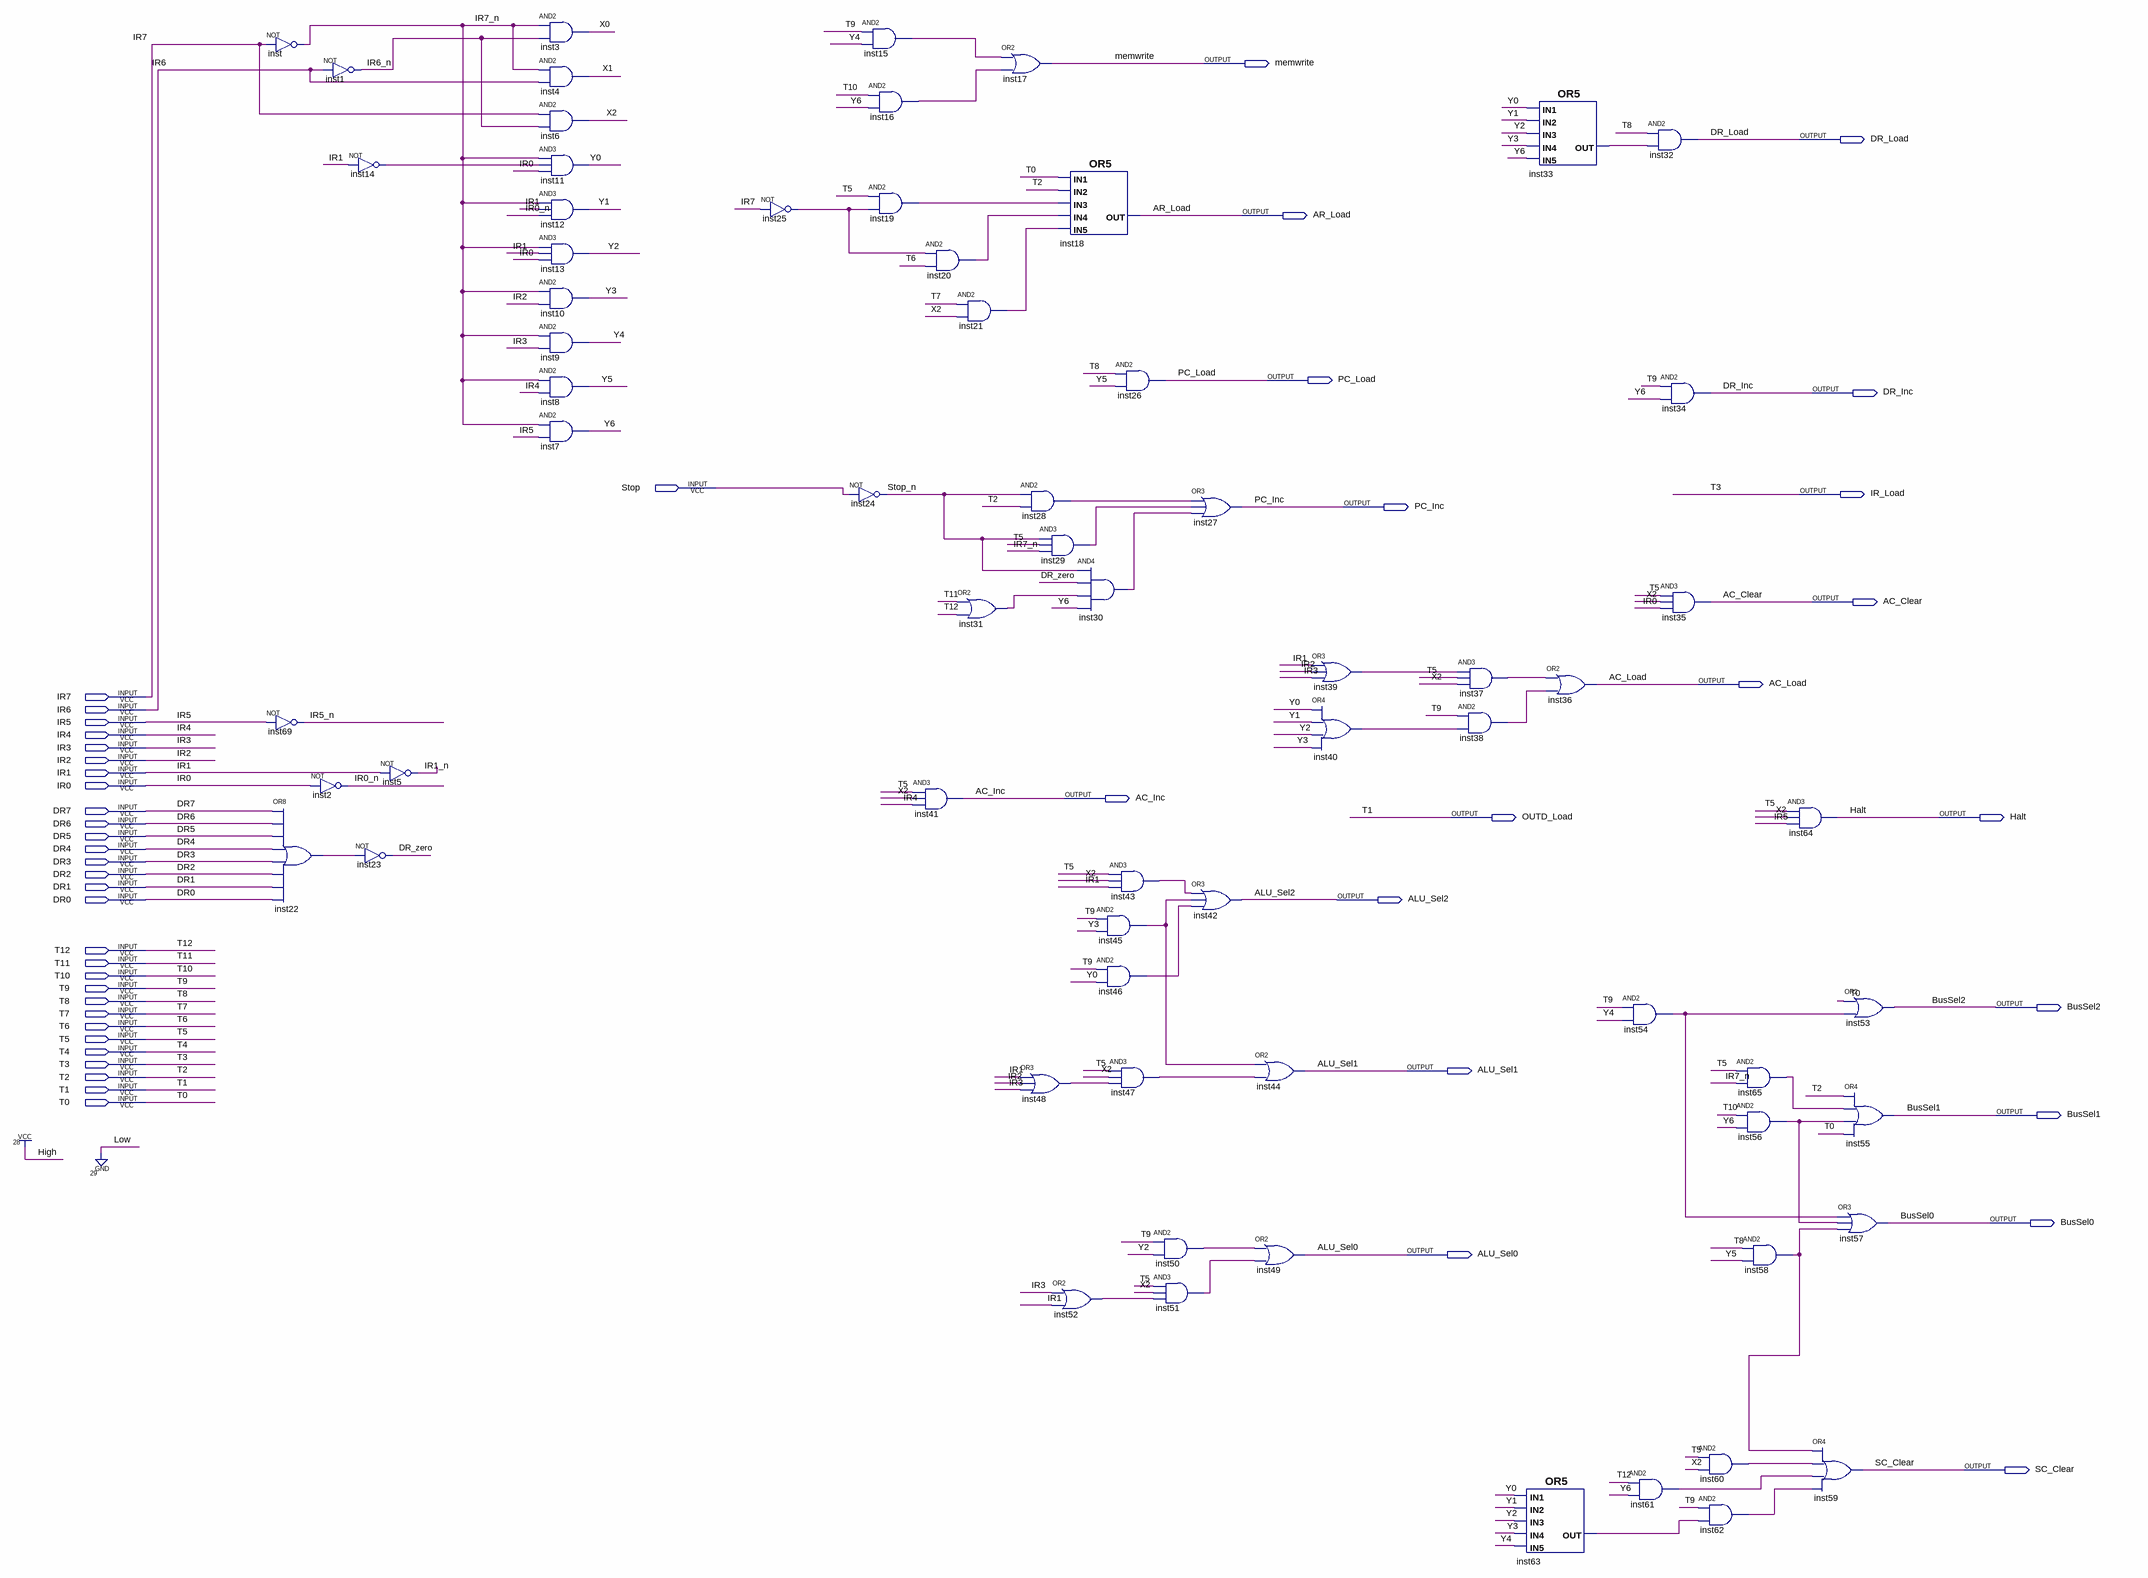
[diagram p0: schematic sheet]
// Quartus schematic lab4controller.bdf as structural Verilog: 67 symbols, 49 pins
module lab4controller (
  input  Stop,
  input  IR7,
  input  IR6,
  input  IR5,
  input  IR4,
  input  IR3,
  input  IR2,
  input  IR1,
  input  IR0,
  input  DR7,
  input  DR6,
  input  DR5,
  input  DR4,
  input  DR3,
  input  DR2,
  input  DR1,
  input  DR0,
  input  T12,
  input  T11,
  input  T10,
  input  T9,
  input  T8,
  input  T7,
  input  T6,
  input  T5,
  input  T4,
  input  T3,
  input  T2,
  input  T1,
  input  T0,
  output memwrite,
  output DR_Load,
  output AR_Load,
  output PC_Load,
  output DR_Inc,
  output IR_Load,
  output PC_Inc,
  output AC_Clear,
  output AC_Load,
  output AC_Inc,
  output OUTD_Load,
  output Halt,
  output ALU_Sel2,
  output BusSel2,
  output ALU_Sel1,
  output BusSel1,
  output BusSel0,
  output ALU_Sel0,
  output SC_Clear
);

  wire DR_zero, inst14_out, inst15_out, inst16_out, inst19_out, inst20_out, inst21_out, inst22_out,
       inst25_out, inst28_out, inst29_out, inst30_out, inst31_out, inst33_out, inst37_out, inst38_out,
       inst39_out, inst40_out, inst43_out, inst45_out, inst46_out, inst47_out, inst48_out, inst50_out,
       inst51_out, inst52_out, inst54_out, inst56_out, inst58_out, inst60_out, inst61_out, inst62_out,
       inst63_out, inst65_out, IR0_n, IR1_n, IR5_n, IR6_n, IR7_n, Stop_n, X0, X1, X2, Y0, Y1, Y2, Y3, Y4, Y5,
       Y6;

  not inst (IR7_n, IR7);
  not inst69 (IR5_n, IR5);
  not inst2 (IR0_n, IR0);
  or inst22 (inst22_out, DR7, DR6, DR5, DR4, DR3, DR2, DR1, DR0);
  not inst1 (IR6_n, IR6);
  not inst14 (inst14_out, IR1);
  not inst23 (DR_zero, inst22_out);
  not inst5 (IR1_n, IR1);
  and inst3 (X0, IR7_n, IR6_n);
  and inst4 (X1, IR7_n, IR6);
  and inst6 (X2, IR7, IR6_n);
  and inst11 (Y0, IR7_n, inst14_out, IR0);
  and inst12 (Y1, IR7_n, IR1, IR0_n);
  and inst13 (Y2, IR7_n, IR1, IR0);
  and inst10 (Y3, IR7_n, IR2);
  and inst9 (Y4, IR7_n, IR3);
  and inst8 (Y5, IR7_n, IR4);
  and inst7 (Y6, IR7_n, IR5);
  not inst25 (inst25_out, IR7);
  and inst15 (inst15_out, T9, Y4);
  and inst16 (inst16_out, T10, Y6);
  and inst19 (inst19_out, T5, inst25_out);
  not inst24 (Stop_n, Stop);
  and inst20 (inst20_out, inst25_out, T6);
  and inst41 (AC_Inc, T5, X2, IR4);
  and inst21 (inst21_out, T7, X2);
  or inst31 (inst31_out, T11, T12);
  or inst17 (memwrite, inst15_out, inst16_out);
  and inst28 (inst28_out, Stop_n, T2);
  or inst48 (inst48_out, IR1, IR2, IR3);
  or inst18 (AR_Load, T0, T2, inst19_out, inst20_out, inst21_out);
  and inst29 (inst29_out, Stop_n, T5, IR7_n);
  and inst30 (inst30_out, Stop_n, DR_zero, inst31_out, Y6);
  or inst52 (inst52_out, IR3, IR1);
  and inst26 (PC_Load, T8, Y5);
  and inst43 (inst43_out, T5, X2, IR1);
  and inst45 (inst45_out, T9, Y3);
  and inst46 (inst46_out, T9, Y0);
  and inst47 (inst47_out, T5, X2, inst48_out);
  and inst50 (inst50_out, T9, Y2);
  and inst51 (inst51_out, T5, X2, inst52_out);
  or inst27 (PC_Inc, inst28_out, inst29_out, inst30_out);
  or inst42 (ALU_Sel2, inst43_out, inst45_out, inst46_out);
  or inst44 (ALU_Sel1, inst45_out, inst47_out);
  or inst49 (ALU_Sel0, inst50_out, inst51_out);
  or inst39 (inst39_out, IR1, IR2, IR3);
  or inst40 (inst40_out, Y0, Y1, Y2, Y3);
  and inst37 (inst37_out, inst39_out, T5, X2);
  and inst38 (inst38_out, T9, inst40_out);
  or inst33 (inst33_out, Y0, Y1, Y2, Y3, Y6);
  or inst63 (inst63_out, Y0, Y1, Y2, Y3, Y4);
  or inst36 (AC_Load, inst37_out, inst38_out);
  and inst54 (inst54_out, T9, Y4);
  and inst61 (inst61_out, T12, Y6);
  and inst32 (DR_Load, T8, inst33_out);
  and inst34 (DR_Inc, T9, Y6);
  and inst35 (AC_Clear, T5, X2, IR0);
  and inst65 (inst65_out, T5, IR7_n);
  and inst56 (inst56_out, T10, Y6);
  and inst60 (inst60_out, T5, X2);
  and inst62 (inst62_out, T9, inst63_out);
  and inst64 (Halt, T5, X2, IR5);
  and inst58 (inst58_out, T8, Y5);
  or inst57 (BusSel0, inst54_out, inst56_out, inst58_out);
  or inst59 (SC_Clear, inst58_out, inst60_out, inst61_out, inst62_out);
  or inst53 (BusSel2, T0, inst54_out);
  or inst55 (BusSel1, T2, inst65_out, inst56_out, T0);

  assign IR_Load = T3;
  assign OUTD_Load = T1;
endmodule
